# EasyEDA Pro project ProDocument_ESP32C3WROOM_EINK_2024-05-29.epro

# Schematic schematic_esp32c3wroom
Create Date: 2024-05-07; Page Name: P1; Project Name: 2.9寸/1.54寸桌面墨水屏摆件_main; Schematic Name: Schematic_ESP32C3WROOM; Update Date: 2024-05-07; Company: 嘉立创EDA; Page Size: A4; Version: V1.0
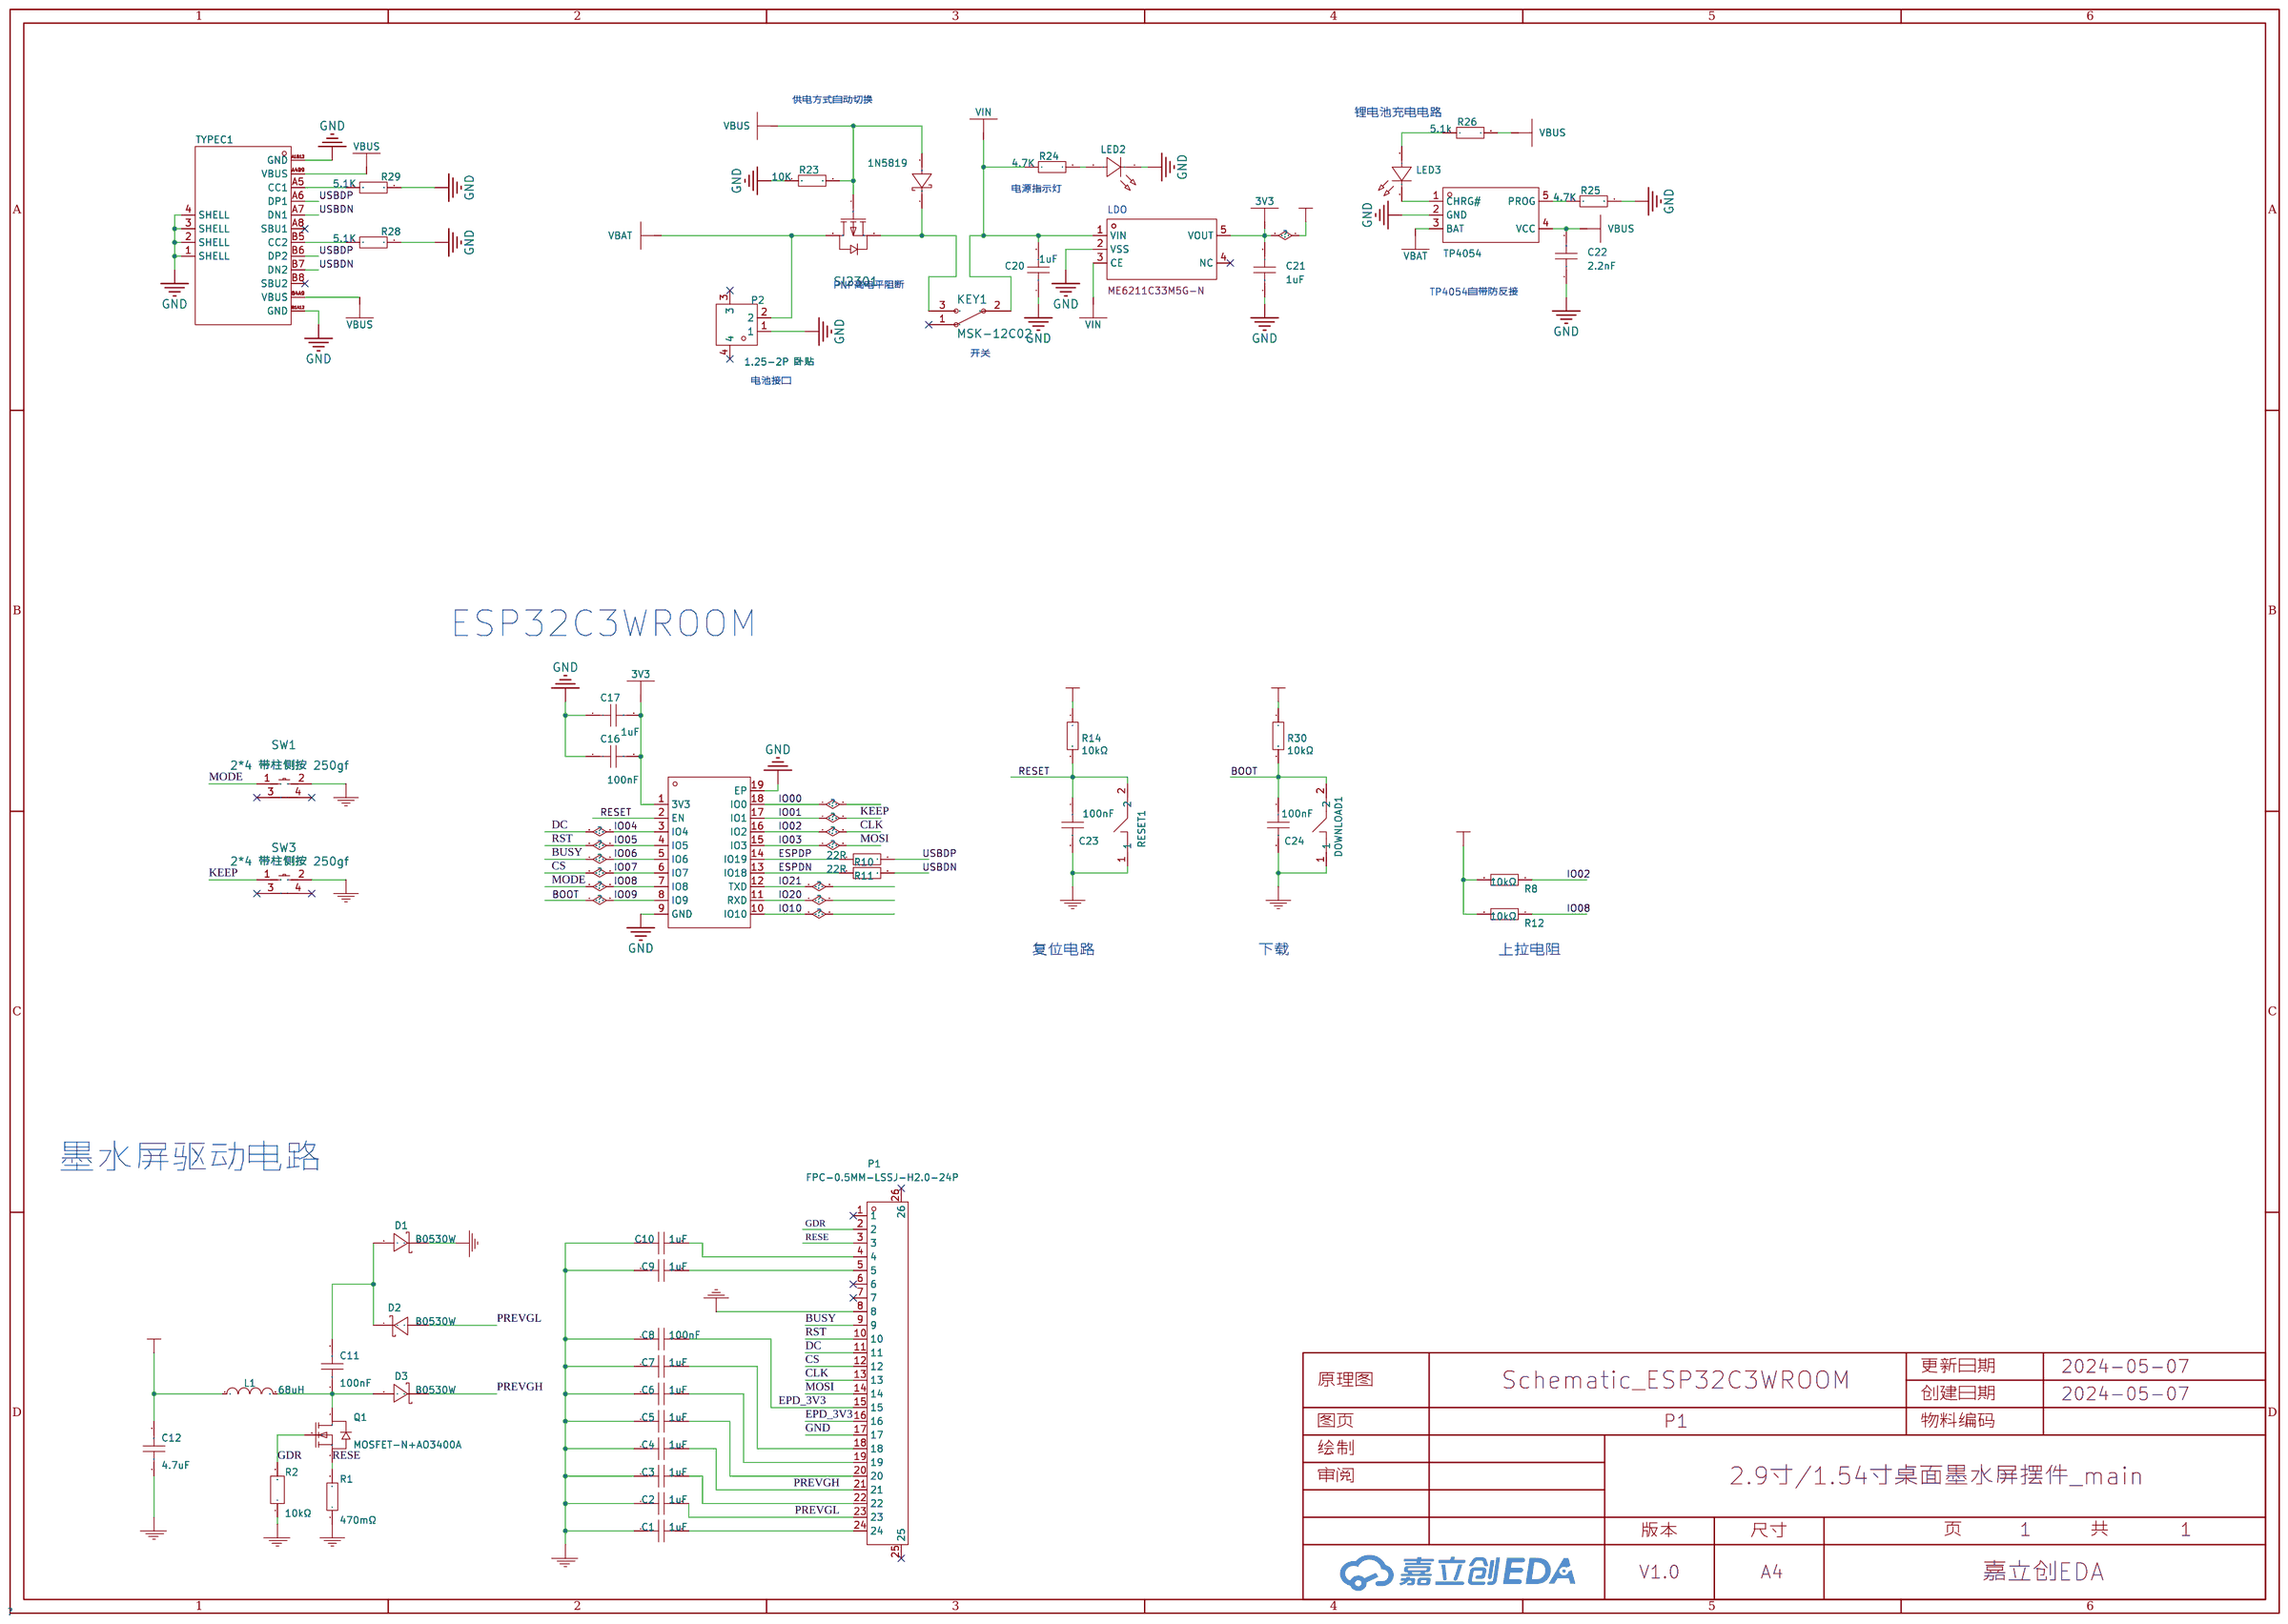
[diagram p0: schematic sheet]

## Parts
1N5819  -  [SOD-123_L2.8-W1.8-LS3.7-RD]
C1  1uF  [C0603]
C2  1uF  [C0603]
C3  1uF  [C0603]
C4  1uF  [C0603]
C5  1uF  [C0603]
C6  1uF  [C0603]
C7  1uF  [C0603]
C8  100nF  [C0603]
C9  1uF  [C0603]
C10  1uF  [C0603]
C11  100nF  [C0603]
C12  4.7uF  [C0603]
C16  100nF  [C0603]
C17  1uF  [C0603]
C20  1uF  [C0603]
C21  1uF  [C0603]
C22  2.2nF  [C0603]
C23  100nF  [C0603]
C24  100nF  [C0603]
D1  B0530W  [SOD-123_L2.7-W1.7-LS3.8-RD]
D2  B0530W  [SOD-123_L2.7-W1.7-LS3.8-RD]
D3  B0530W  [SOD-123_L2.7-W1.7-LS3.8-RD]
DOWNLOAD1  1TS002E-2500-2500  [KEY-SMD_L6.1-W3.7-LS8.0]
KEY1  MSK-12C02  [MSK-11027]
L1  68uH  [IND-SMD_L3.5-W3.0]
LDO1  -  [SOT-23-5_L3.0-W1.7-P0.95-LS2.8-BR]
LED2  充电指示灯  [LED0603-RD_GREEN]
LED3  充电指示灯  [LED0603-RD_GREEN]
P1  FPC-0.5MM-LSSJ-H2.0-24P  [FPC-0.5MM-LSSJ-H2.0-24P]
P2  1.25-2P 卧贴  [CONN-SMD_P1.25-2P_1.25WT-2P]
Q1  MOSFET-N+AO3400A  [SOT-23-3_L2.9-W1.3-P1.90-LS2.4-BR]
Q2  SI2301  [sot-23-3_l2.9-w1.3-p1.90-ls2.4-br]
R1  470mΩ  [R0603]
R2  10kΩ  [R0603]
R8  10kΩ  [R0603]
R10  22R  [R0603]
R11  22R  [R0603]
R12  10kΩ  [R0603]
R14  10kΩ  [R0603]
R23  10K  [R0603]
R24  4.7K  [R0603]
R25  4.7K  [R0603]
R26  5.1k  [R0603]
R28  5.1K  [R0603]
R29  5.1K  [R0603]
R30  10kΩ  [R0603]
RESET1  1TS002E-2500-2500  [KEY-SMD_L6.1-W3.7-LS8.0]
SW1  2*4 带柱侧按 250gf  [2*4 带柱侧按 250gf]
SW3  2*4 带柱侧按 250gf  [2*4 带柱侧按 250gf]
TYPEC1  -  [usb-c-smd_type-c16pin]
U1  -  [BULETM-SMD_ESPRESSIF_ESP32-C3-WROOM-02-N4-4MB]
U7  TP4054  [SOT-23-5_L2.9-W1.6-P0.95-LS2.8-BL]

## Library data of the parts
1N5819 = 1N5817W: 二极管配置:独立式;直流反向耐压(Vr):20V;平均整流电流(Io):1A;正向压降(Vf):750mV@3A;反向电流(Ir):1mA@20V;; LCSC Part Name: 20V 1A 750mV@3A; Supplier Part: C727113; Manufacturer: TWGMC(台湾迪嘉); Supplier Footprint: SOD-123; JLCPCB Part Class: Extended Part; Datasheet: https://atta.szlcsc.com/upload/public/pdf/source/20200828/C727113_260B72EC53C389C21DF1E8AB243F1BFC.pdf; Supplier: LCSC; Diode Configuration: 独立式; Reverse Voltage (Vr): 20V; Average Rectified Current (Io): 1A; Forward Voltage (Vf@If): 750mV@3A; Reverse Leakage Current (Ir): 1mA@20V
C1-C7 C9 C10 = CC0603KRX7R9BB105: 容值:1uF;精度:±10%;额定电压:50V;温度系数:X7R;; LCSC Part Name: 1uF ±10% 50V; Supplier Part: C559769; Manufacturer: YAGEO(国巨); Supplier Footprint: 0603; JLCPCB Part Class: Extended Part; Datasheet: https://atta.szlcsc.com/upload/public/pdf/source/20181031/C325451_C7CF01155AE3010E0D610C52F5FE7D31.pdf; Supplier: LCSC; Tolerance: ±10%; Voltage Rated: 50V; Temperature Coefficient: X7R
C8 C11 = CL10B104KA8NNNC: 容值:100nF;精度:±10%;额定电压:25V;温度系数:X7R;; LCSC Part Name: 100nF ±10% 25V; Supplier Part: C1590; Manufacturer: SAMSUNG(三星); Supplier Footprint: 0603; JLCPCB Part Class: Extended Part; Datasheet: https://atta.szlcsc.com/upload/public/pdf/source/20160103/1457707680294.pdf; Supplier: LCSC; Tolerance: ±10%; Voltage Rated: 25V; Temperature Coefficient: X7R
C12 = GRM188C81E475KE11D: 容值:4.7uF;精度:±10%;额定电压:-;温度系数:-;; LCSC Part Name: 4.7uF ±10%; Supplier Part: C417145; Manufacturer: muRata(村田); Supplier Footprint: 0603; JLCPCB Part Class: Extended Part; Datasheet: https://atta.szlcsc.com/upload/public/pdf/source/20190902/C417145_DA4D96EAA9A94EF2F661514AA7241F14.pdf; Supplier: LCSC; Tolerance: ±10%
C16 C17 C20-C22 = CAP_0603: Supplier Footprint: 0603
C23 C24 = 100nF: link: https://item.szlcsc.com/362304.html; 3DModel: C0603_L1.6-W0.8-H0.8; Supplier: LCSC; Manufacturer: FH; Manufacturer Part: 0603B104J500NT; Supplier Part: C88136; JLCPCB Part Class: Extended Part
D1-D3 = B0530W: 直流反向耐压(Vr):30V;平均整流电流(Io):500mA;正向压降(Vf):430mV@500mA;; LCSC Part Name: 30V 500mA 430mV@500mA; Supplier Part: C475611; Manufacturer: SHIKUES(时科); Supplier Footprint: SOD-123; JLCPCB Part Class: Extended Part; Datasheet: https://atta.szlcsc.com/upload/public/pdf/source/20200102/C475611_1FD52CC1D526791C7DF3DD595BBBBB9C.pdf; Supplier: LCSC; Reverse Voltage (Vr): 30V; Average Rectified Current (Io): 500mA; Forward Voltage (Vf@If): 430mV@500mA
DOWNLOAD1 RESET1 = 1TS002E-2500-2500: link: https://item.szlcsc.com/300363.html; 3DModel: KEY-SMD_2P-L6.1-W3.7-H2.5-LS8.0; Supplier: LCSC; Supplier Part: C329185; Manufacturer: HYP; JLCPCB Part Class: Extended Part
KEY1 = MSK12C02: Supplier: LCSC; Manufacturer: SHOU HAN; Supplier Part: C431540
L1 = SMNR3015-680MT: 电感值:68uH;精度:±20%;额定电流:-;直流电阻(DCR):-;; LCSC Part Name: 68uH ±20%; Supplier Part: C467049; Manufacturer: SXN(顺翔诺); Supplier Footprint: SMD; JLCPCB Part Class: Extended Part; Datasheet: https://atta.szlcsc.com/upload/public/pdf/source/20210810/8C07D4BA256EC9B57FF3FBBF0FDAC34D.pdf; Supplier: LCSC; Tolerance: ±20%
LDO1 = ME6211C33M5G-N: 输出类型:固定;输出极性:正;输出通道数:1;最大输入电压:6V;输出电压:3.3V;压差:260mV@(200mA);输出电流:500mA;电源纹波抑制比(PRSS):70dB@(1kHz),62dB@(10kHz);; LCSC Part Name: Vin=6V Vout=3.3V 500mA 70dB@(1kHz),62dB@(10kHz); Supplier Part: C82942; Manufacturer: MICRONE(南京微盟); Supplier Footprint: SOT-23-5; JLCPCB Part Class: Extended Part; Datasheet: https://atta.szlcsc.com/upload/public/pdf/source/20170918/C82942_1505727073070976520.pdf; Supplier: LCSC; Output Type: 固定; Output Polarity: 正; Number of Outputs: 1; Maximum Input Voltage: 6V; Output Voltage: 3.3V; Dropout Voltage: 260mV@(200mA); Output Current: 500mA; Power Supply Rejection Ratio (PRSS): 70dB@(1kHz),62dB@(10kHz)
LED2 LED3 = 19-219/GHC-YR2T1B5Y/3T: 发光颜色：绿灯 透镜颜色：无色透明 主波长：518nm 峰值波长：525nm 测试电流：20mA 正向电压; LCSC Part Name: 0603正贴式 绿灯(Iv=140~360mcd) @IF=20mA); Supplier Part: C2994781; Manufacturer: EVERLIGHT(台湾亿光); Supplier Footprint: 0603; JLCPCB Part Class: Extended Part; Datasheet: https://atta.szlcsc.com/upload/public/pdf/source/20220419/8956FAA3247BD76AC23F3FF602030F9E.pdf; Supplier: LCSC
P1 = F0501-T-24-20T-R: 间距:0.5mm;触点数量:24;锁定特性:抽屉式;安装类型:卧贴;触点类型:上接;; LCSC Part Name: 0.5mm P数:24 抽屉式 上接; Supplier Part: C501498; Manufacturer: XFCN(台湾兴飞); Supplier Footprint: SMD,P=0.5mm; JLCPCB Part Class: Extended Part; Datasheet: https://atta.szlcsc.com/upload/public/pdf/source/20200107/C481229_B906A53CF5971505C8B1DEC03B333341.pdf; Supplier: LCSC; Pitch: 0.5mm; Number of Contacts: 24; Locking Feature: 抽屉式; Mounting Type: 卧贴; Contact Type: 上接; Height Above Board: 2mm
P2 = 1.25-2PWB: 参考系列:-;间距:1.25mm;插针结构:1x2P;排数:1;每排PIN数:2;行距:-;公母:公型插针;安装方式:卧贴;额定电流:-;工作温度范围:-40~+85;; LCSC Part Name: 1.25mm 1x2P 卧贴; Supplier Part: C2905009; Manufacturer: DEALON(德艺隆); Supplier Footprint: SMD,P=1.25mm; JLCPCB Part Class: Extended Part; Datasheet: https://atta.szlcsc.com/upload/public/pdf/source/20211025/32B11FCE5054D08D2841E43E3DE676AA.pdf; Supplier: LCSC; Pitch: 1.25mm; Pins Structure: 1x2P; Number of Rows: 1; Number of PINs Per Row: 2; Gender: 公型插针; Mounting Style: 卧贴; Operating Temperature Range: -40~+85
Q1 = AO3400A: 类型:N沟道;漏源电压(Vdss):30V;连续漏极电流(Id):5.2A;功率(Pd):1W;导通电阻(RDS(on)@Vgs,Id):35mΩ@10V,5A;阈值电压(Vgs(th)@Id):1.5V@250A;; LCSC Part Name: N沟道 30V 5.2A; Supplier Part: C700953; Manufacturer: HUASHUO(华朔); Supplier Footprint: SOT-23; JLCPCB Part Class: Extended Part; Datasheet: https://atta.szlcsc.com/upload/public/pdf/source/20200713/C700953_2C399A25E2B0CA38CA8BE1B404780CC1.pdf; Supplier: LCSC; Type: N沟道; Drain Source Voltage (Vdss): 30V; Continuous Drain Current (Id): 5.2A; Power Dissipation (Pd): 1W; Drain Source On Resistance (RDS(on)@Vgs,Id): 35mΩ@10V,5A; Gate Threshold Voltage (Vgs(th)@Id): 1.5V@250A
Q2 = si2301ads-t1: 类型:-;漏源电压(Vdss):-;连续漏极电流(Id):-;功率(Pd):-;导通电阻(RDS(on)@Vgs,Id):-;阈值电压(Vgs(th)@Id):-;栅极电荷(Qg@Vgs):-;输入电容(Ciss@Vds):-;反向传输电容(Crss@Vds):-;; LCSC Part Name: SI2301ADS-T1; Supplier Part: C725155; Manufacturer: VBsemi(台湾微碧); Manufacturer Part: SI2301ADS-T1; Supplier Footprint: SOT-23-3; JLCPCB Part Class: Extended Part; Datasheet: https://atta.szlcsc.com/upload/public/pdf/source/20200819/C725155_91C1870C39E8B18609957AA328449A25.pdf; Supplier: LCSC
R1 = 0603WAF470LT5E: 电阻类型:厚膜电阻;阻值:470mΩ;精度:±1%;功率:1/10W;温度系数:±800ppm/;最大工作电压:75V;工作温度范围:-55~+155;; LCSC Part Name: 0.47Ω ±1%; Supplier Part: C23411; Manufacturer: UNI-ROYAL(厚声); Supplier Footprint: 0603; JLCPCB Part Class: Extended Part; Datasheet: https://atta.szlcsc.com/upload/public/pdf/source/20200306/C422600_1E6D84923E4A46A82E41ADD87F860B5C.pdf; Supplier: LCSC; Type: 厚膜电阻; Tolerance: ±1%; Power(Watts): 1/10W; Temperature Coefficient: ±800ppm/; Overload Voltage (Max): 75V; Operating Temperature Range: -55~+155
R2 = SG73P1JTTD1002F: 阻值:10kΩ;精度:±1%;功率:-;温度系数:-;; LCSC Part Name: 10kΩ ±1%; Supplier Part: C880254; Manufacturer: KOA; Supplier Footprint: 0603; JLCPCB Part Class: Extended Part; Datasheet: https://atta.szlcsc.com/upload/public/pdf/source/20190109/C346159_A2BB9C83E7E727C8F8277542505B206B.pdf; Supplier: LCSC; Tolerance: ±1%
R8 R12 R14 R30 = 10kΩ: 3DModel: R0603_L1.6-W0.8-H0.8; link: https://www.mouser.in/datasheet/2/447/PYu_RT_1_to_0_01_RoHS_L_11-1669912.pdf; Supplier: LCSC; Manufacturer: FH; Manufacturer Part: RS-03K103JT; Supplier Part: C73809; Resistance: 10K; JLCPCB Part Class: Extended Part
R10 R11 R23-R26 R28 R29 = Res_0603: Supplier Footprint: 0603
SW1 SW3 = 2*4 带柱侧按 250gf: Supplier: 立创商城; link: https://item.taobao.com/item.htm?spm=a1z10.3-c-s.w4002-21223910208.9.6ab86a4bB2ALq0&id=546690284515; Manufacturer: BRIGHT(博瑞泰)
TYPEC1 = TYPEC12PINCONN: Supplier Part: C9900004950; Supplier Footprint: TYPE-C16PIN母座; JLCPCB Part Class: Extended Part; Supplier: LCSC
U1 = ESP32-C3-WROOM-02-N4: Supplier Part: C2934560; Manufacturer: ESPRESSIF 乐鑫; JLCPCB Part Class: Extended Part; Datasheet: https://atta.szlcsc.com/upload/public/pdf/source/20220106/F07459EFFE1D7CBA94B4FB8A075146A6.pdf; Supplier: LCSC
U7 = TP4054ST25K: 充电电池的类型:-;电池单元组数:-;最大充电电流:-;充满的电池组电压:-;最大供应电压:-;; LCSC Part Name: 鋰電池充電IC; Supplier Part: C382138; Manufacturer: TPOWER(天源); Supplier Footprint: SOT-23-5; JLCPCB Part Class: Extended Part; Datasheet: https://atta.szlcsc.com/upload/public/pdf/source/20190327/C382138_4F9C2BC46B0AE6EB53479EF4BB386887.pdf; Supplier: LCSC

## Nets
3V3: C8.2 C12.2 C16.2 C17.2 C21.2 L1.1 LDO1.5(VOUT) P1.15 P1.16 R8.2 R12.2 R14.1 R30.1 U1.1(3V3)
GND: C1.1 C2.1 C3.1 C4.1 C5.1 C6.1 C7.1 C8.1 C9.1 C10.1 C12.1 C16.1 C17.1 C20.1 C21.1 C22.1 C23.2 C24.2 D1.1(K) DOWNLOAD1.1 LDO1.2(VSS) LED2.1(K) P1.8 P1.17 P2.1 R1.1 R2.1 R23.1 R25.2 R28.2 R29.2 RESET1.1 SW1.2 SW3.2 TYPEC1.1(SHELL) TYPEC1.2(SHELL) TYPEC1.3(SHELL) TYPEC1.4(SHELL) TYPEC1.A1B12(GND) TYPEC1.B1A12(GND) U1.9(GND) U1.19(EP) U7.2(GND)
VBAT: P2.2 Q2.3(D) U7.3(BAT)
VBUS: 1N5819.2(A) C22.2 Q2.1(G) R23.2 R26.2 TYPEC1.A4B9(VBUS) TYPEC1.B4A9(VBUS) U7.4(VCC)
VIN: C20.2 KEY1.2 LDO1.1(VIN) LDO1.3(CE) R24.1
BOOT: C24.1 DOWNLOAD1.2 R30.2 U1.8(IO9)
BUSY: P1.9 U1.5(IO6)
CLK: P1.13 R8.1 U1.16(IO2)
CS: P1.12 U1.6(IO7)
DC: P1.11 U1.3(IO4)
ESPDN: R11.1 U1.13(IO18)
ESPDP: R10.1 U1.14(IO19)
GDR: P1.2 Q1.1(G) R2.2
IO00: U1.18(IO0)
IO01: SW3.1 U1.17(IO1)
IO03: P1.14 U1.15(IO3)
IO05: P1.10 U1.4(IO5)
IO08: R12.1 SW1.1 U1.7(IO8)
IO10: U1.10(IO10)
IO20: U1.11(RXD)
IO21: U1.12(TXD)
PREVGH: C4.2 D3.1(K) P1.21
PREVGL: C2.2 D2.2(A) P1.23
RESE: P1.3 Q1.2(S) R1.2
RESET: C23.1 R14.2 RESET1.2 U1.2(EN)
USBDN: R11.2 TYPEC1.A7(DN1) TYPEC1.B7(DN2)
USBDP: R10.2 TYPEC1.A6(DP1) TYPEC1.B6(DP2)
$1N1402: C11.1 D3.2(A) L1.2 Q1.3(D)
$1N1408: C10.2 P1.4
$1N1409: C9.2 P1.5
$1N1426: C7.2 P1.18
$1N1427: C5.2 P1.20
$1N1428: C3.2 P1.22
$1N1429: C1.2 P1.24
$1N1433: C6.2 P1.19
$1N1443: C11.2 D1.2(A) D2.1(K)
$1N4128: LED2.2(A) R24.2
$1N4131: R25.1 U7.5(PROG)
$1N4133: LED3.2(A) R26.1
$1N4135: LED3.1(K) U7.1(CHRG#)
$1N4655: 1N5819.1(C) KEY1.3 Q2.2(S)
$1N4891: R29.1 TYPEC1.A5(CC1)
$1N4892: R28.1 TYPEC1.B5(CC2)

Not connected (* = marked no-connect by the designer): KEY1 1*; LDO1 4(NC)*; P1 1* 6* 7* 25* 26*; P2 3* 4*; SW1 3* 4*; SW3 3* 4*; TYPEC1 A8(SBU1)* B8(SBU2)*

## Notes on the sheet
- 供电方式自动切换
- 锂电池充电电路
- 电源指示灯
- LDO
- PNP高电平阻断
- TP4054自带防反接
- 开关
- 电池接口
- ESP32C3WROOM
- 复位电路
- 下载
- 上拉电阻
- 墨水屏驱动电路

# Board PCB_ESP32C3WROOM
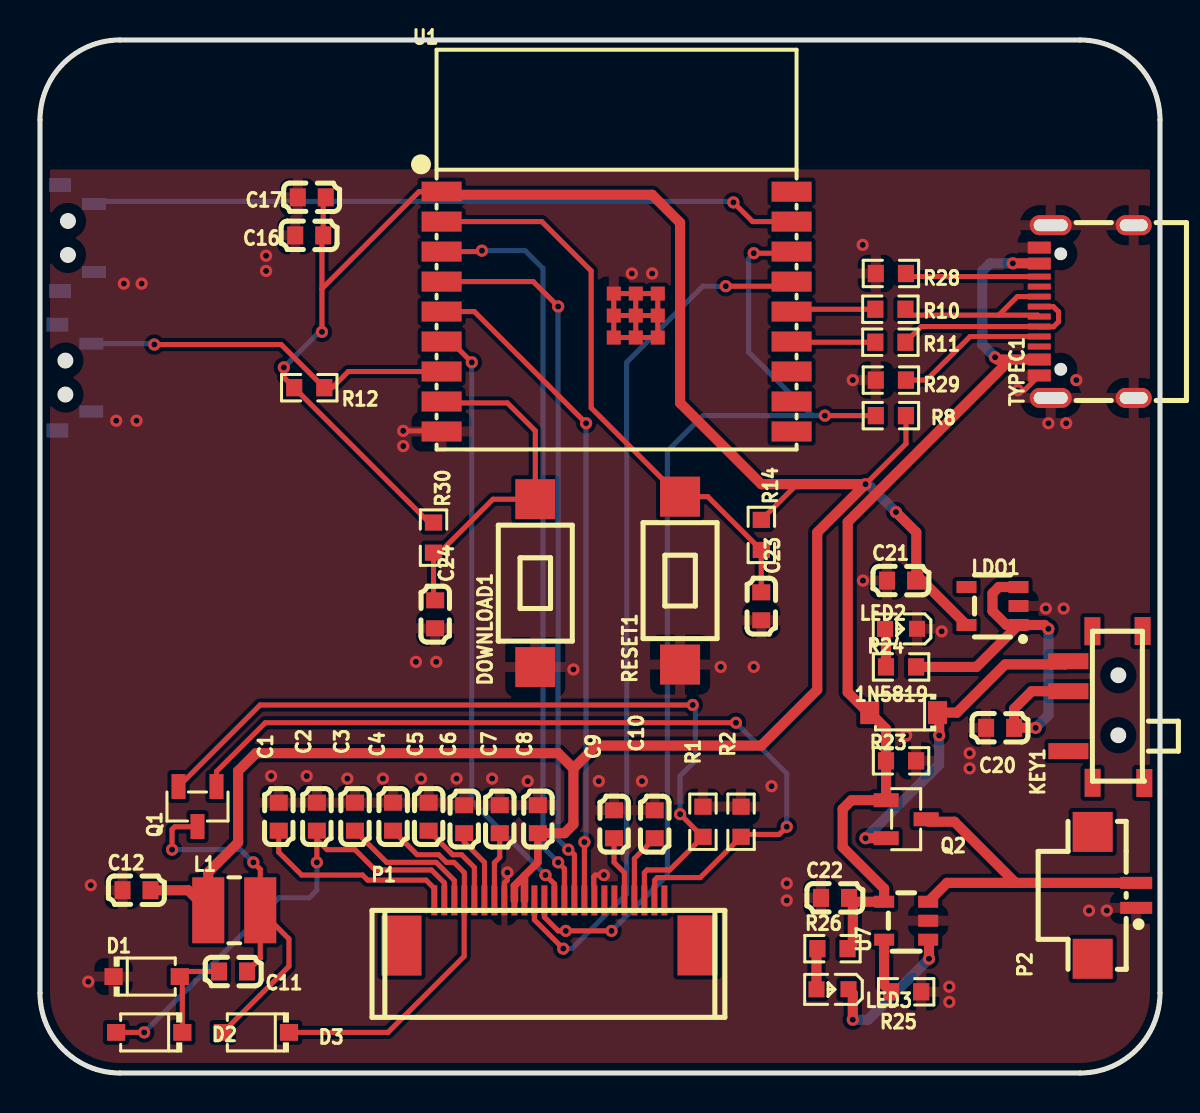
[diagram p1: board, top side]
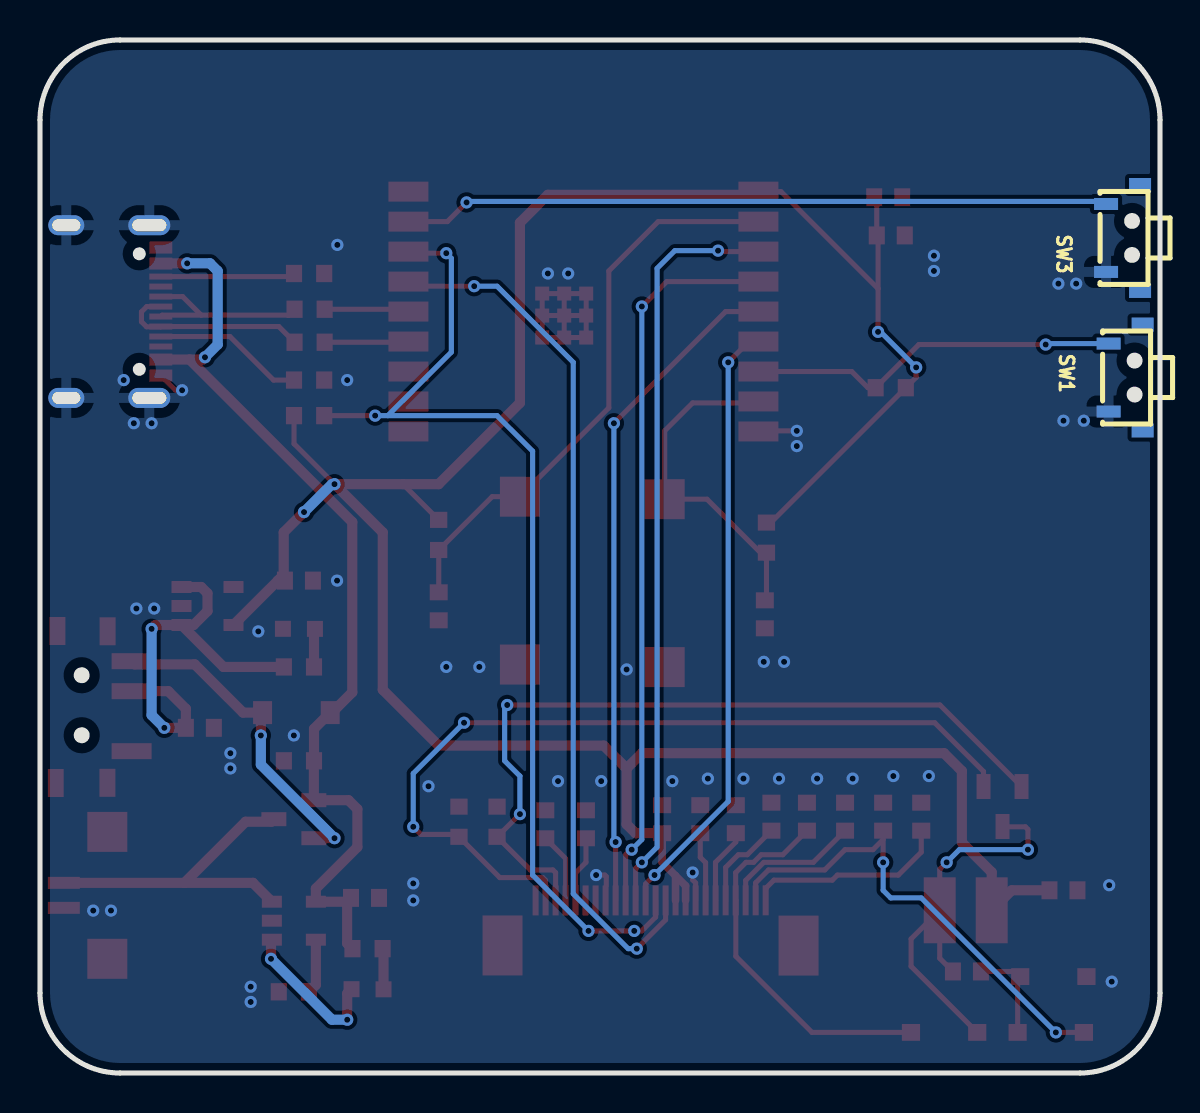
[diagram p2: board, bottom side, seen from below]

Outline 56 x 51.69 mm; copper layers: Top Layer, Bottom Layer. Coordinates in mm from the lower left corner of the outline.
Outline path: 0,47.69 0,4 arc(1.17,1.17) 4,0 52,0 arc(54.83,1.17) 56,4 56,47.69 arc(54.83,50.52) 52,51.69 4,51.69 arc(1.17,50.52) 0,47.69
Stack: Top Layer 0.035mm / Dielectric1 1.51mm FR4 er 4.5 / Bottom Layer 0.035mm

## Design rules (mm)
template: JLCPCB Capability(Two Layers Board)
spacing copperThickness1oz (default): track to track 0.102, other pairs 0.152 to 0.3
spacing copperThickness2oz: track to track 0.203, other pairs 0.152 to 0.3
track width copperThickness1oz (default): min 0.127, default 0.254, max 2.54
track width copperThickness2oz: min 0.203, default 0.254, max 2.54
differential pair differentialPair (default): width min 0.127, default 0.254, max 2.54; gap min 0.152, default 0.152
via viaSize (default): diameter min 0.5, default 0.61, max 10; hole min 0.3, default 0.305, max 6.3

## Placement (name value [footprint] x y rotation side)
1N5819  -  [SOD-123_L2.8-W1.8-LS3.7-RD]  43.18 18.03 180 top
C1  1uF  [C0603]  11.94 12.83 270 top
C2  1uF  [C0603]  13.84 12.83 270 top
C3  1uF  [C0603]  15.75 12.83 270 top
C4  1uF  [C0603]  17.65 12.83 270 top
C5  1uF  [C0603]  19.43 12.83 270 top
C6  1uF  [C0603]  21.21 12.7 270 top
C7  1uF  [C0603]  22.99 12.7 270 top
C8  100nF  [C0603]  24.89 12.7 270 top
C9  1uF  [C0603]  28.7 12.45 270 top
C10  1uF  [C0603]  30.73 12.45 270 top
C11  100nF  [C0603]  9.65 5.08 180 top
C12  4.7uF  [C0603]  4.83 9.14 0 top
C16  100nF  [C0603]  13.46 41.91 0 top
C17  1uF  [C0603]  13.59 43.81 0 top
C20  1uF  [C0603]  48.01 17.27 0 top
C21  1uF  [C0603]  43.05 24.64 0 top
C22  2.2nF  [C0603]  39.75 8.76 0 top
C23  100nF  [C0603]  36.06 23.35 270 top
C24  100nF  [C0603]  19.76 22.95 270 top
D1  B0530W  [SOD-123_L2.7-W1.7-LS3.8-RD]  5.33 4.83 0 top
D2  B0530W  [SOD-123_L2.7-W1.7-LS3.8-RD]  5.46 2.03 180 top
D3  B0530W  [SOD-123_L2.7-W1.7-LS3.8-RD]  10.79 2.03 180 top
DOWNLOAD1  1TS002E-2500-2500  [KEY-SMD_L6.1-W3.7-LS8.0]  24.76 24.51 90 top
KEY1  MSK-12C02  [MSK-11027]  50.42 14.6 90 top
L1  68uH  [IND-SMD_L3.5-W3.0]  9.71 8.14 0 top
LDO1  -  [SOT-23-5_L3.0-W1.7-P0.95-LS2.8-BR]  47.62 23.37 0 top
LED2  充电指示灯  [LED0603-RD_GREEN]  43.05 22.22 180 top
LED3  充电指示灯  [LED0603-RD_GREEN]  39.62 4.19 180 top
P1  -  [FPC-0.5MM-LSSJ-H2.0-24P]  23.62 6.1 0 top
P2  1.25-2P 卧贴  [CONN-SMD_P1.25-2P_1.25WT-2P]  53.72 8.89 90 top
Q1  MOSFET-N+AO3400A  [SOT-23-3_L2.9-W1.3-P1.90-LS2.4-BR]  7.87 13.33 90 top
Q2  SI2301  [sot-23-3_l2.9-w1.3-p1.90-ls2.4-br]  43.31 12.7 180 top
R1  470mΩ  [R0603]  33.15 12.57 270 top
R2  10kΩ  [R0603]  35.05 12.57 270 top
R8  10kΩ  [R0603]  42.54 32.89 0 top
R10  22R  [R0603]  42.52 38.22 0 top
R11  22R  [R0603]  42.52 36.56 0 top
R12  10kΩ  [R0603]  13.46 34.29 180 top
R14  10kΩ  [R0603]  36.07 26.92 270 top
R23  10K  [R0603]  43.05 15.62 180 top
R24  4.7K  [R0603]  43.05 20.32 180 top
R25  4.7K  [R0603]  43.31 4.06 0 top
R26  5.1k  [R0603]  39.62 6.22 0 top
R28  5.1K  [R0603]  42.54 40 180 top
R29  5.1K  [R0603]  42.54 34.67 180 top
R30  10kΩ  [R0603]  19.68 26.79 270 top
RESET1  1TS002E-2500-2500  [KEY-SMD_L6.1-W3.7-LS8.0]  32 24.64 90 top
SW1  -  [2*4 带柱侧按 250gf]  1.27 34.8 270 bottom
SW3  -  [2*4 带柱侧按 250gf]  1.4 41.78 270 bottom
TYPEC1  -  [usb-c-smd_type-c16pin]  52.32 38.1 90 top
U1  -  [BULETM-SMD_ESPRESSIF_ESP32-C3-WROOM-02-N4-4MB]  28.83 38.1 0 top
U7  TP4054  [SOT-23-5_L2.9-W1.6-P0.95-LS2.8-BL]  43.31 7.62 90 top

## Footprints (pads in the part's own frame, mm; a bottom-side part is the same pattern mirrored in y, then rotated)
2*4 带柱侧按 250gf
  rect 0.6x1.2 smd: 1(-1.7,-1.3) 2(1.7,-1.3)
  rect 0.7x1.1 smd: 3(2.65,0.4) 4(-2.65,0.4)
BULETM-SMD_ESPRESSIF_ESP32-C3-WROOM-02-N4-4MB
  rect 2x1 smd: 1(-8.75,6) 2(-8.75,4.5) 3(-8.75,3) 4(-8.75,1.5) 5(-8.75,0) 6(-8.75,-1.5) 7(-8.75,-3) 8(-8.75,-4.5) 9(-8.75,-6) 10(8.75,-6) 11(8.75,-4.5) 12(8.75,-3) 13(8.75,-1.5) 14(8.75,0) 15(8.75,1.5) 16(8.75,3) 17(8.75,4.5) 18(8.75,6)
  rect 0.7x0.7 smd: 19(-0.14,0.9) 19(-0.14,-0.2) 19(-0.14,-1.3) 19(0.96,0.9) 19(0.96,-0.2) 19(0.96,-1.3) 19(2.06,0.9) 19(2.06,-0.2) 19(2.06,-1.3)
C0603
  rect 0.8x0.9 smd: 1(-0.7,0) 2(0.7,0)
CONN-SMD_P1.25-2P_1.25WT-2P
  rect 0.6x1.6 smd: 1(-0.625,-1.087) 2(0.625,-1.087)
  rect 2x2 smd: 3(3.175,1.087) 4(-3.175,1.087)
FPC-0.5MM-LSSJ-H2.0-24P
  rect 0.3x1.5 smd: 1(7.597,2.542) 2(7.098,2.542) 3(6.598,2.542) 4(6.098,2.542) 5(5.598,2.542) 6(5.098,2.542) 7(4.598,2.542) 8(4.098,2.542) 9(3.598,2.542) 10(3.098,2.542) 11(2.598,2.542) 12(2.098,2.542) 13(1.597,2.542) 14(1.097,2.542) 15(0.601,2.542) 16(0.098,2.542) 17(-0.403,2.541) 18(-0.902,2.542) 19(-1.402,2.542) 20(-1.904,2.545) 21(-2.405,2.545) 22(-2.904,2.545) 23(-3.405,2.545) 24(-3.905,2.545)
  rect 2x3 smd: 25(-5.549,0.281) 26(9.252,0.287)
IND-SMD_L3.5-W3.0
  rect 1.6x3.3 smd: 1(-1.3,0) 2(1.3,0)
KEY-SMD_L6.1-W3.7-LS8.0
  rect 2x2 smd: 1(-4.2,0) 2(4.2,0)
LED0603-RD_GREEN
  rect 0.8x0.8 smd: 1(-0.8,-0.003) 2(0.8,0.003)
MSK-11027
  rect 0.8x2 smd: 1(1.5,-1) 2(4.5,-1) 3(6,-1)
  rect 1.4x0.8 smd: 4(-0.084,-2.21) 5(7.5,-2.201) 6(7.512,-4.71) 7(-0.093,-4.796)
R0603
  rect 0.806x0.864 smd: 1(-0.753,0) 2(0.753,0)
SOD-123_L2.7-W1.7-LS3.8-RD
  rect 0.909x0.841 smd: 1(-1.656,0) 2(1.656,0)
SOD-123_L2.8-W1.8-LS3.7-RD
  rect 0.95x1.15 smd: 1(-1.692,0) 2(1.692,0)
SOT-23-3_L2.9-W1.3-P1.90-LS2.4-BR
  rect 1.25x0.7 smd: 1(1,-0.95) 2(1,0.95) 3(-1,0)
sot-23-3_l2.9-w1.3-p1.90-ls2.4-br
  rect 1.25x0.7 smd: 1(1,-0.95) 2(1,0.95) 3(-1,0)
SOT-23-5_L2.9-W1.6-P0.95-LS2.8-BL
  rect 0.6x1.001 smd: 1(-0.95,-1.1) 2(0,-1.1) 3(0.95,-1.1) 4(0.95,1.1) 5(-0.95,1.1)
SOT-23-5_L3.0-W1.7-P0.95-LS2.8-BR
  rect 1x0.6 smd: 1(1.3,-0.95) 2(1.3,0) 3(1.3,0.95) 4(-1.3,0.95) 5(-1.3,-0.95)
usb-c-smd_type-c16pin
  oval 1.001x2.1 hole 0.6x1.7: 1(-4.321,1.788) 2(4.321,1.788)
  oval 1.001x1.801 hole 0.6x1.399: 3(-4.321,-2.362) 4(4.321,-2.362)
  rect 0.6x1.151 smd: A1B12(-3.2,2.362) A4B9(-2.401,2.362) B1A12(3.2,2.362) B4A9(2.401,2.362)
  rect 0.299x1.151 smd: A5(-1.25,2.362) A6(-0.249,2.362) A7(0.249,2.362) A8(-1.75,2.362) B5(1.75,2.362) B6(0.75,2.362) B7(-0.75,2.362) B8(1.25,2.362)

## Nets
As in the schematic.

Pads without a net: KEY1 1 4 5 6 7; LDO1 4; P1 1 6 7 25 26; P2 3 4; SW1 3 4; SW3 3 4; TYPEC1 A8 B8

## Via types
v1: diameter 0.61, hole 0.305, Top Layer to Bottom Layer, 85 vias

## Routing (per net, layer and track width the routed paths; a pad name or vN(x,y) marks a point on that pad's centre or on a via; arc(x,y) is an arc through that point)
3V3: length 140.8
  Top Layer w0.254: C17.2 14.16,43.69 C16.2 14.1,41.84 14.1,39.24 ; U1.1 18.95,44.1 14.1,39.24 ; v1(12.19,35.31) 12.19,34.81 R12.2 19.46,27.54 19.68,27.54 ; 14.1,39.24 v1(14.1,37.08) ; 37.85,29.46 R14.1 ; R8.2 43.3,31.49 v1(41.28,29.46)
  Top Layer w0.381: C8.2 24.89,10.54 24.22,9.87 ; 24.22,9.87 P1.15 ; 24.22,9.87 23.72,9.37 P1.16
  Top Layer w0.508: U1.1 20.24,43.94 30.61,43.94 32,42.54 32,33.53 36.07,29.46 v1(41.28,29.46) 38.86,27.05 38.86,19.18 36.07,16.38 27.81,16.38 26.67,15.24 ; C12.2 7.41,9.14 L1.1 8.41,10.05 9.91,11.54 9.91,15.11 10.79,16 25.91,16 26.67,15.24 ; 44.1,24.64 C21.2 ; 44.1,24.64 43.81,24.93 43.81,27.05 v1(42.8,28.07) ; 44.1,24.64 LDO1.5 ; 26.67,15.24 26.67,12.45 26.22,12 C8.2
  Bottom Layer w0.254: v1(14.1,37.08) 14.1,37.21 v1(12.19,35.31)
  Bottom Layer w0.508: v1(42.8,28.07) 41.4,29.46 v1(41.28,29.46)
GND: length 18.9
  Top Layer w0.254: 29.79,37.9 U1.19 ; 29.79,37.9 29.79,39 ; 29.79,37.9 29.79,36.8 ; 29.79,37.9 28.69,37.9 ; U1.19 U1.19 29.79,36.8 ; U1.19 U1.19 29.79,39 ; v1(23.37,10.03) 23.37,9.66 23.22,9.51 P1.17 ; U1.9 20.05,32.13 v1(18.16,32.13) ; 29.79,39 28.69,39 28.69,37.9 ; 28.69,37.9 28.69,36.8 29.79,36.8 ; 27.69,9.4 27.69,9.83 27.76,9.91 v1(28.19,9.91) ; v1(48.9,34.16) 49.22,34.16 TYPEC1.A1B12
  vias: v1(2.41,4.57) v1(2.54,9.4) v1(3.81,32.64) v1(4.19,39.5) v1(4.83,32.64) v1(5.08,39.5) v1(11.3,40.89) v1(11.3,40.13) v1(11.56,14.86) v1(13.34,14.86) v1(15.37,14.73) v1(17.15,14.73) v1(18.16,31.37) v1(18.8,20.57) v1(19.05,14.73) v1(19.81,20.57) v1(20.83,14.73) v1(22.61,14.73) v1(24.38,14.6) v1(26.67,20.19) v1(27.94,14.6) v1(29.59,40) v1(30.1,14.6) v1(30.61,40) v1(34.04,20.32) v1(35.69,20.32) v1(36.58,14.35) v1(37.34,9.49) v1(37.34,8.64) v1(40.64,34.67) v1(41.13,41.44) v1(41.15,24.64) v1(43.31,16.89) v1(45.09,22.1) v1(45.47,4.32) v1(45.47,3.56) v1(46.48,16) v1(46.48,15.24) v1(50.29,23.24) v1(50.42,32.51) v1(51.18,23.24) v1(51.31,32.51) v1(51.82,34.67) v1(52.45,8.13) v1(53.34,8.13)
VBAT: length 16.6
  Top Layer w0.508: Q2.3 44.43,12.57 45.72,12.57 48.78,9.51 ; 48.78,9.51 45.35,9.51 44.41,8.57 ; 48.78,9.51 P2.2
VBUS: length 48.3
  Top Layer w0.508: 48.52,35.7 47.87,35.7 v1(47.75,35.81) ; 48.52,35.7 TYPEC1.A4B9 ; 48.52,35.7 40.39,27.57 40.39,19.05 41.4,18.03 1N5819.2 42.3,17.22 R23.2 42.31,15.61 Q2.1 40.57,13.65 40.13,13.21 40.13,11.3 42.21,9.23 U7.4 40.64,8.57 ; TYPEC1.B4A9 49.95,40.51 v1(48.64,40.51) ; 40.64,8.57 C22.2 ; 40.64,8.57 40.64,6.49 R26.2
  Bottom Layer w0.508: v1(47.75,35.81) 47.12,36.45 47.12,40.13 47.5,40.51 v1(48.64,40.51)
VIN: length 21.8
  Top Layer w0.508: LDO1.3 47.94,24.32 47.62,24 47.62,23.11 48.32,22.42 LDO1.1 ; v1(49.78,17.27) C20.2 48.71,18.23 49.59,19.1 KEY1.2 ; LDO1.1 46.83,20.32 R24.1 ; LDO1.1 50.23,22.42 v1(50.42,22.22)
  Bottom Layer w0.508: v1(49.78,17.27) 50.42,17.91 v1(50.42,22.22)
BOOT: length 17.5
  Top Layer w0.254: 19.68,25.74 22.65,28.71 DOWNLOAD1.2 24.76,32.13 23.37,33.53 20.15,33.53 U1.8 ; 19.68,25.74 R30.2 ; 19.68,25.74 19.68,23.73 C24.1
BUSY: length 33.5
  Top Layer w0.254: v1(27.31,32.51) 21.72,38.1 U1.5 ; P1.9 v1(27.22,11.56)
  Bottom Layer w0.254: v1(27.31,32.51) 27.31,11.64 v1(27.22,11.56) 27.31,11.56
CLK: length 52.3
  Top Layer w0.254: R8.1 v1(39.24,32.89) ; v1(28.57,7.11) v1(26.29,7.11) 25.91,7.11 25.22,7.8 P1.13 ; v1(35.69,41.02) 37.5,41.02 U1.16
  Bottom Layer w0.254: v1(35.69,41.02) 35.43,40.77 35.43,36.07 38.61,32.89 ; v1(39.24,32.89) 38.61,32.89 ; 38.61,32.89 33.15,32.89 31.37,31.11 31.37,9.91 v1(28.57,7.11)
CS: length 30.6
  Top Layer w0.254: P1.12 25.72,9.46 v1(25.27,9.91) ; U1.6 20.55,36.6 v1(21.59,35.56)
  Bottom Layer w0.254: v1(25.27,9.91) 21.59,13.59 v1(21.59,35.56)
DC: length 37.5
  Top Layer w0.254: v1(25.91,10.54) 26.22,10.23 P1.11 ; U1.3 22.05,41.1 v1(22.1,41.15)
  Bottom Layer w0.254: v1(25.91,10.54) 25.15,11.3 25.15,40.26 24.26,41.15 v1(22.1,41.15)
ESPDN: length 4.2
  Top Layer w0.254: R11.1 37.61,36.56 U1.13
ESPDP: length 4.2
  Top Layer w0.254: U1.14 37.69,38.22 R10.1
GDR: length 42.7
  Top Layer w0.254: v1(37.34,12.32) 36.96,11.94 35.17,11.94 R2.2 33.01,9.78 30.86,9.78 30.73,9.65 30.73,9.4 30.72,9.38 P1.2 ; Q1.1 8.82,15.09 11.26,17.53 v1(34.8,17.53)
  Bottom Layer w0.254: v1(34.8,17.53) 37.34,14.99 v1(37.34,12.32)
IO01: length 35.4
  Top Layer w0.254: v1(34.67,43.56) 35.63,42.6 U1.17
  Bottom Layer w0.254: v1(34.67,43.56) 34.62,43.61 2.57,43.61
IO03: length 43.8
  Top Layer w0.254: P1.14 24.72,7.67 v1(26.16,6.22) ; v1(34.29,39.37) 37.35,39.37 U1.15
  Bottom Layer w0.254: v1(34.29,39.37) 33.15,39.37 29.34,35.56 29.34,8.97 26.59,6.22 v1(26.16,6.22)
IO05: length 36.4
  Top Layer w0.254: P1.10 26.72,10.92 26.47,11.18 v1(26.42,11.18) ; v1(25.91,38.35) 24.66,39.6 U1.4
  Bottom Layer w0.254: v1(25.91,38.35) 25.91,11.68 v1(26.42,11.18)
IO08: length 18.8
  Top Layer w0.254: v1(5.72,36.45) 12.06,36.45 R12.1 14.6,34.29 15.41,35.1 U1.7
  Bottom Layer w0.254: v1(5.72,36.45) 5.67,36.5 SW1.1
PREVGH: length 19
  Top Layer w0.254: C4.2 18.86,10.92 19.94,10.92 20.32,10.54 20.7,10.54 21.22,10.02 P1.21 21.21,8.63 21.21,5.84 17.4,2.03 D3.1
PREVGL: length 24.3
  Top Layer w0.254: 13.84,11.68 C2.2 ; 13.84,11.68 13.84,10.67 13.72,10.54 v1(13.84,10.54) ; 13.84,11.68 14.35,11.18 15.75,11.18 16.76,10.16 19.57,10.16 20.22,9.52 P1.23 ; D2.2 v1(5.21,2.03)
  Bottom Layer w0.254: v1(13.84,10.54) 13.84,9.14 13.46,8.76 11.94,8.76 v1(5.21,2.03)
RESE: length 40
  Top Layer w0.254: P1.3 30.22,10.03 30.35,10.16 31.49,10.16 R1.2 33.14,11.82 v1(32,12.95) ; v1(32.64,18.41) 11,18.41 Q1.2
  Bottom Layer w0.254: v1(32,12.95) 32,14.86 32.77,15.62 32.77,18.41 v1(32.64,18.41)
RESET: length 28.9
  Top Layer w0.254: U1.2 25.09,42.6 27.56,40.13 27.56,33.28 RESET1.2 33.39,28.84 36.06,26.16 ; 36.06,26.16 R14.2 ; 36.06,26.16 C23.1
USBDN: length 9.7
  Top Layer w0.254: R11.2 44.06,37.35 TYPEC1.B7 49.97,37.34 50.67,37.34 50.93,37.59 50.93,38.09 50.66,38.35 TYPEC1.A7
USBDP: length 9.2
  Top Layer w0.254: 47.94,37.92 48.87,38.85 TYPEC1.B6 ; 47.94,37.92 43.57,37.92 R10.2 ; 47.94,37.92 49.89,37.92 TYPEC1.A6
$1N1402: length 20.6
  Top Layer w0.254: v1(10.67,10.54) 11.01,10.2 11.01,8.14 ; 11.01,8.14 12.45,6.71 12.45,5.34 9.14,2.03 ; 11.01,8.14 11.01,5.74 C11.1 ; v1(6.6,11.18) 6.6,12.19 6.73,12.32 7.86,12.32 Q1.3
  Bottom Layer w0.254: v1(6.6,11.18) 10.03,11.18 v1(10.67,10.54)
$1N1408: length 3.5
  Top Layer w0.254: P1.4 29.72,10.73 C10.2
$1N1409: length 3.3
  Top Layer w0.254: C9.2 28.7,10.54 29.22,10.02 P1.5
$1N1426: length 3.5
  Top Layer w0.254: P1.18 22.72,10.53 22.99,10.79 C7.2
$1N1427: length 4.7
  Top Layer w0.254: P1.20 21.72,10.29 21.08,10.92 20.64,10.92 C5.2
$1N1428: length 7
  Top Layer w0.254: P1.22 20.72,9.63 19.81,10.54 17.33,10.54 C3.2
$1N1429: length 10.2
  Top Layer w0.254: P1.24 19.72,9.24 19.3,9.65 16.38,9.65 16.13,9.91 13.08,9.91 11.94,11.05 C1.2
$1N1433: length 3.8
  Top Layer w0.254: C6.2 21.21,11.56 22.22,10.54 22.22,8.64 P1.19
$1N1443: length 4.9
  Top Layer w0.254: D2.1 7.12,4.7 D1.2 7.24,5.08 C11.2
$1N4128: length 1.9
  Top Layer w0.508: R24.2 42.3,22.18 LED2.2
$1N4131: length 2.7
  Top Layer w0.508: U7.5 42.21,4.41 R25.1
$1N4133: length 2.1
  Top Layer w0.508: LED3.2 38.82,6.18 R26.1
$1N4135: length 7.7
  Top Layer w0.508: 44.41,6.67 44.45,6.63 v1(44.45,5.71) ; LED3.1 40.64,3.98 v1(40.64,2.67)
  Bottom Layer w0.508: v1(40.64,2.67) 41.4,2.67 v1(44.45,5.71)
$1N4655: length 16.5
  Top Layer w0.508: KEY1.3 51.26,20.45 48.26,20.45 45.85,18.03 1N5819.1 44.96,17.95 v1(44.96,16.89) ; Q2.2 v1(41.28,11.75)
  Bottom Layer w0.508: v1(41.28,11.75) 44.96,15.43 v1(44.96,16.89)
$1N4891: length 7.6
  Top Layer w0.254: R29.1 44.32,34.67 46.5,36.85 TYPEC1.A5
$1N4892: length 6.7
  Top Layer w0.254: TYPEC1.B5 43.45,39.85 R28.1

## Copper pours and planes (outline as drawn; the poured copper is in the pictures)
GND on Top Layer: -4.95,55.24 64.13,55.24 64.13,-3.3 -4.95,-3.3
GND on Bottom Layer: -2.79,53.85 60.71,53.85 60.71,-2.41 -2.79,-2.41
